# Altium schematic sheet supply_external.SchDoc: foxBMS BMS-Master
size A3; DocumentNumber: 2; SheetNumber: 2; SheetTotal: 24; Author: Fraunhofer IISB foxBMS Team; REL-DATE: 2017-05-16; VERSION: 1.0.2; SheetDescription: Supply for MCU0 and peripherals
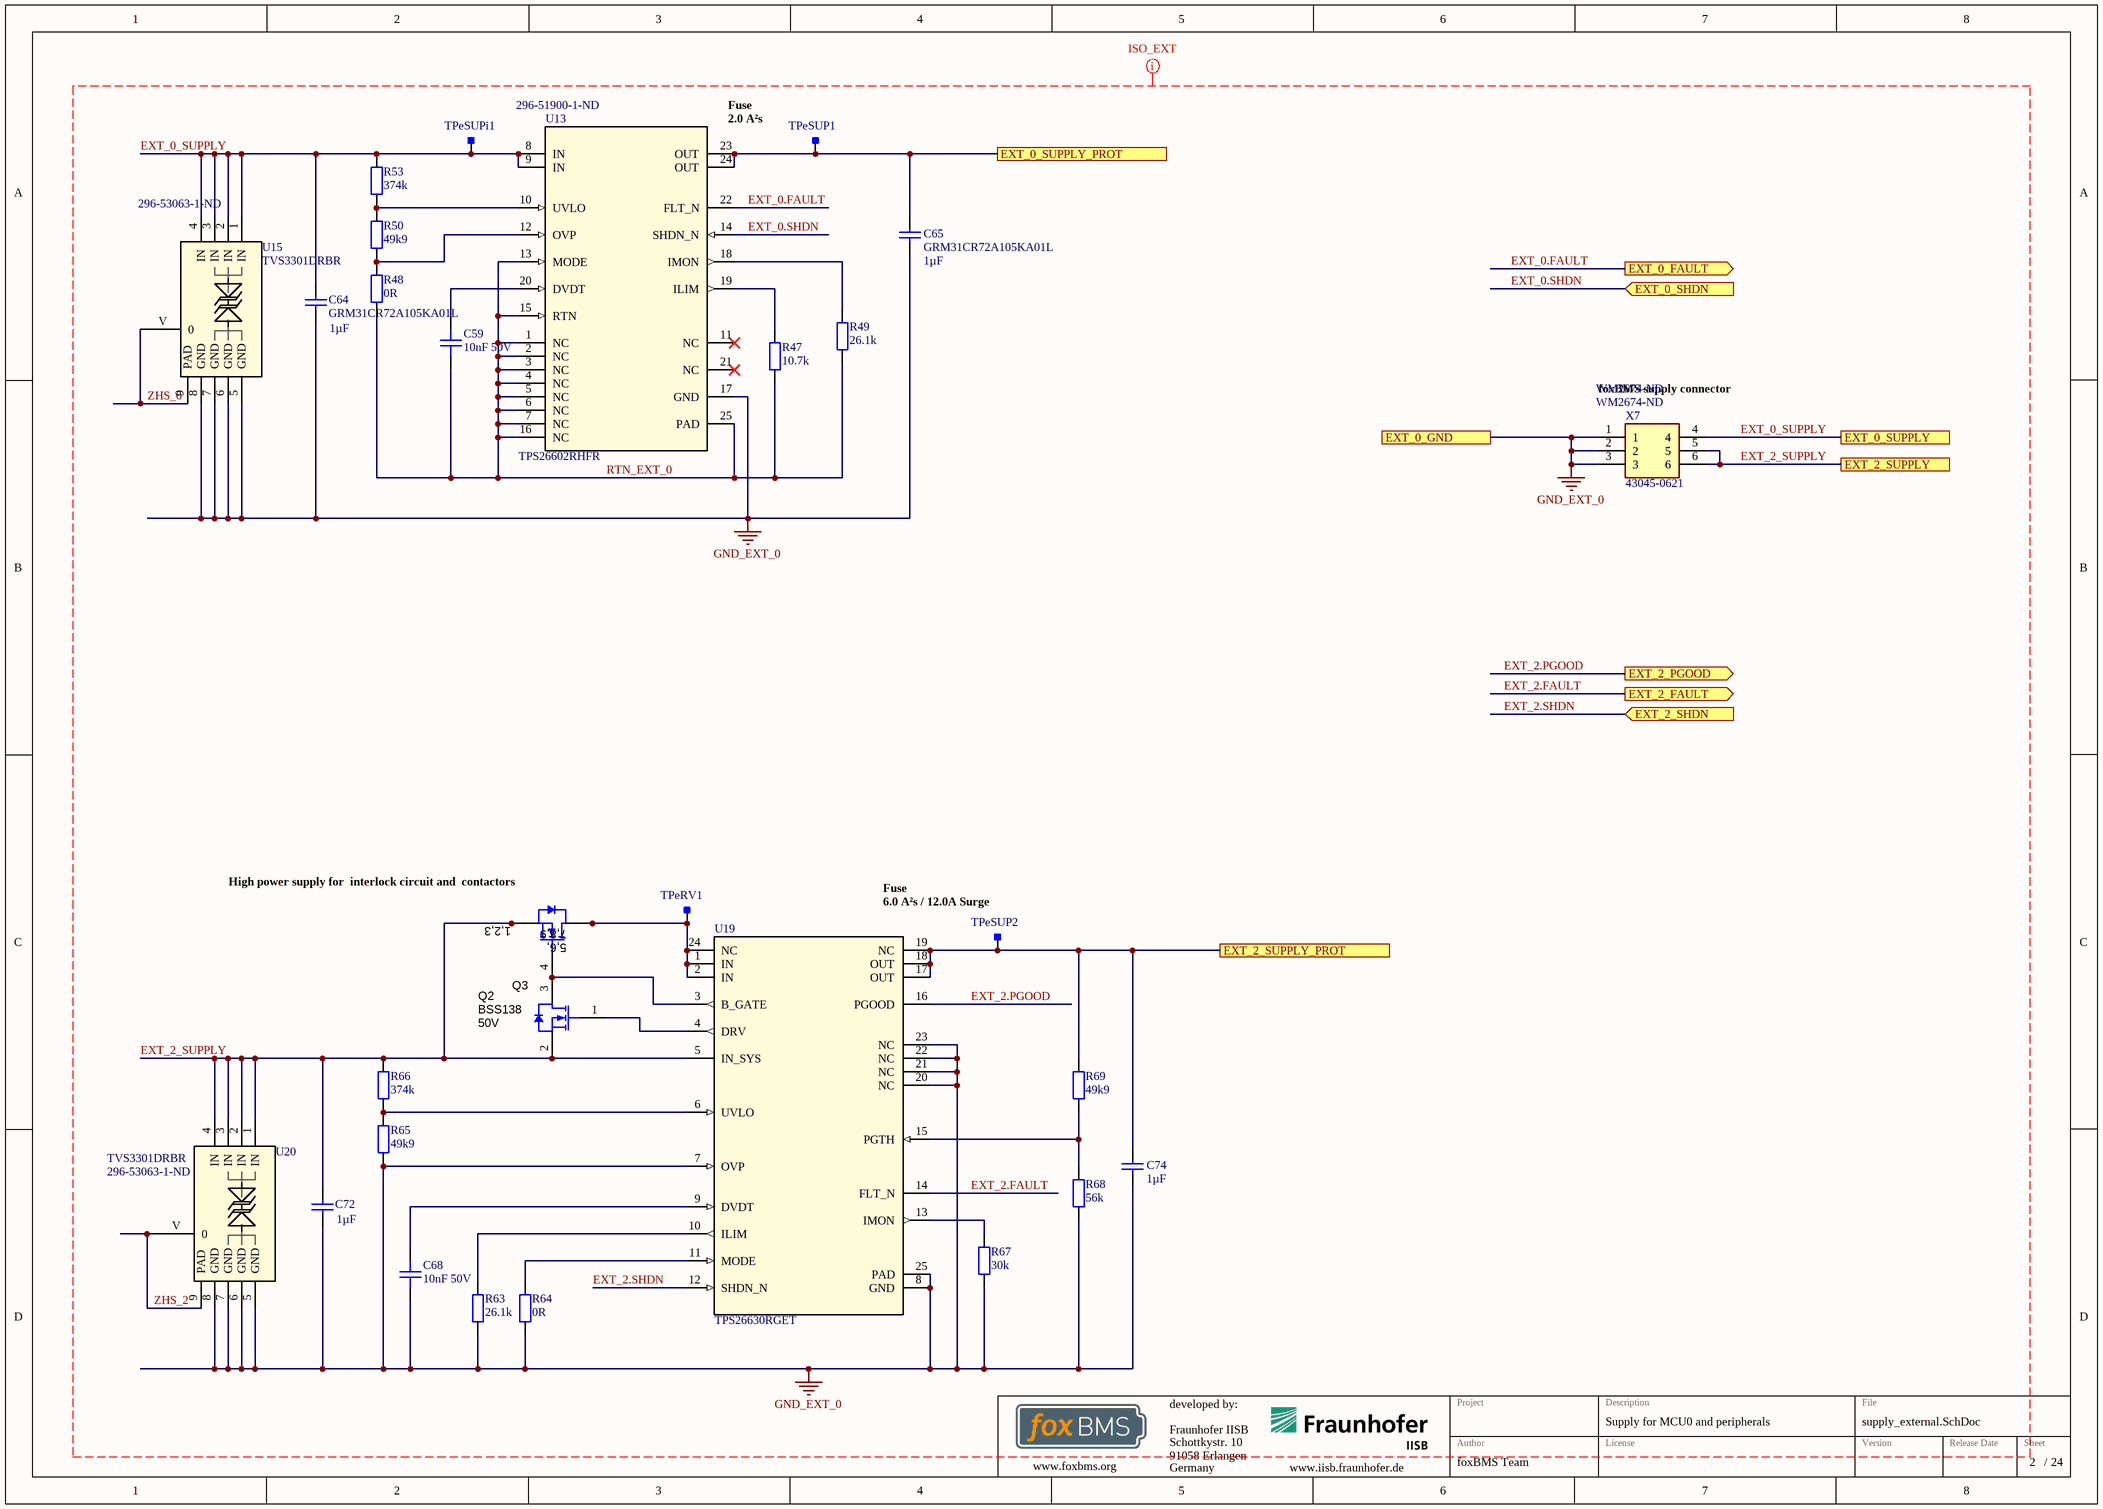
[diagram p0: supply_external.SchDoc]

## Parts
C59  10nF 50V  [0402C]
C64  GRM31CR72A105KA01L  Capacitance: 1µF  [CAPC3216X180X55ML20T25]
C65  GRM31CR72A105KA01L  Capacitance: 1µF  [CAPC3216X180X55ML20T25]
C68  10nF 50V  [0402C]
C72  Capacitance: 1µF  [CAPC3216X180X55ML20T25]  (hidden comment: GRM31CR72A105KA01L)
C74  Capacitance: 1µF  [CAPC3216X180X55ML20T25]  (hidden comment: GRM31CR72A105KA01L)
Q2  BSS138  value 50V  [SOT-23]
Q3  CSD17308Q3  [SONQ3A]  (value not drawn)
R47  10.7k  [0402R]
R48  0R  [0402R]
R49  26.1k  [0402R]
R50  49k9  [0402R]
R53  374k  [0402R]
R63  26.1k  [0402R]
R64  0R  [0402R]
R65  49k9  [0402R]
R66  374k  [0402R]
R67  30k  [0402R]
R68  56k  [0402R]
R69  49k9  [0402R]
TPeRV1  Testpoint_Square  [Testpoint_S1]  (value not drawn)  (no BOM)
TPeSUP1  Testpoint_Square  [Testpoint_S1]  (value not drawn)  (no BOM)
TPeSUP2  Testpoint_Square  [Testpoint_Keystone_Miniature]  (value not drawn)  (no BOM)
TPeSUPi1  Testpoint_Square  [Testpoint_S1]  (value not drawn)  (no BOM)
U13  TPS26602RHFR  Supplier Part Number 1: 296-51900-1-ND  [RHF0024A]
U15  TVS3301DRBR  Supplier Part Number 1: 296-53063-1-ND  [DRB0008F]
U19  TPS26630RGET  [RGE0024H]
U20  TVS3301DRBR  Supplier Part Number 1: 296-53063-1-ND  [DRB0008F]
X7  43045-0621  Supplier Part Number 1: WM2674-ND  [43045-0621]

## Ports
EXT_0_FAULT (out), EXT_0_GND, EXT_0_SHDN (in), EXT_0_SUPPLY, EXT_0_SUPPLY_PROT, EXT_2_FAULT (out), EXT_2_PGOOD (out), EXT_2_SHDN (in), EXT_2_SUPPLY, EXT_2_SUPPLY_PROT

## Nets
GND_EXT_0: C64.1 C65.1 C68.2 C72.1 C74.1 R63.1 R64.1 R65.1 R67.1 R68.1 U13.17(GND) U15.5(GND) U15.6(GND) U15.7(GND) U15.8(GND) U19.7(OVP) U19.8(GND) U19.20(NC) U19.21(NC) U19.22(NC) U19.23(NC) U19.25(PAD) U20.5(GND) U20.6(GND) U20.7(GND) U20.8(GND) X7.1 X7.2 X7.3 ; port EXT_0_GND
EXT_0.FAULT: U13.22(FLT_N) ; port EXT_0_FAULT
EXT_0.SHDN: U13.14(SHDN_N) ; port EXT_0_SHDN
EXT_0_SUPPLY: C64.2 R53.2 TPeSUPi1.1 U13.8(IN) U13.9(IN) U15.1(IN) U15.2(IN) U15.3(IN) U15.4(IN) X7.4 ; port EXT_0_SUPPLY
EXT_0_SUPPLY_PROT: C65.2 TPeSUP1.1 U13.23(OUT) U13.24(OUT) ; port EXT_0_SUPPLY_PROT
EXT_2.FAULT: U19.14(FLT_N) ; port EXT_2_FAULT
EXT_2.PGOOD: U19.16(PGOOD) ; port EXT_2_PGOOD
EXT_2.SHDN: U19.12(SHDN_N) ; port EXT_2_SHDN
EXT_2_SUPPLY: C72.2 Q2.2(S) Q3.1(S) Q3.2(S) Q3.3(S) R66.2 U19.5(IN_SYS) U20.1(IN) U20.2(IN) U20.3(IN) U20.4(IN) X7.5 X7.6 ; port EXT_2_SUPPLY
EXT_2_SUPPLY_PROT: C74.2 R69.2 TPeSUP2.1 U19.17(OUT) U19.18(OUT) U19.19(NC) ; port EXT_2_SUPPLY_PROT
RTN_EXT_0: C59.2 R47.1 R48.1 R49.1 U13.1(NC) U13.2(NC) U13.3(NC) U13.4(NC) U13.5(NC) U13.6(NC) U13.7(NC) U13.13(MODE) U13.15(RTN) U13.16(NC) U13.25(PAD)
ZHS_0: U15.9(PAD) U15.V(0)
ZHS_2: U20.9(PAD) U20.V(0)
NetC59_1: C59.1 U13.20(DVDT)
NetC68_1: C68.1 U19.9(DVDT)
NetQ2_1: Q2.1(G) U19.4(DRV)
NetQ2_3: Q2.3(D) Q3.4(G) U19.3(B_GATE)
NetQ3_5: Q3.5(D) Q3.6(D) Q3.7(D) Q3.8(D) Q3.9(D) TPeRV1.1 U19.1(IN) U19.2(IN) U19.24(NC)
NetR47_2: R47.2 U13.19(ILIM)
NetR48_2: R48.2 R50.1 U13.12(OVP)
NetR49_2: R49.2 U13.18(IMON)
NetR50_2: R50.2 R53.1 U13.10(UVLO)
NetR63_2: R63.2 U19.10(ILIM)
NetR64_2: R64.2 U19.11(MODE)
NetR65_2: R65.2 R66.1 U19.6(UVLO)
NetR67_2: R67.2 U19.13(IMON)
NetR68_2: R68.2 R69.1 U19.15(PGTH)

Not connected (* = marked no-connect by the designer): U13 11(NC)* 21(NC)*

## Layout directives
net class ISO_EXT: EXT_0.FAULT, EXT_0.SHDN, EXT_0_SUPPLY, EXT_2.FAULT, EXT_2.PGOOD, EXT_2.SHDN, EXT_2_SUPPLY, GND_EXT_0, RTN_EXT_0, ZHS_0, ZHS_2

## Notes on the sheet
- Fuse
- 2.0 A²s
- (near X7) foxBMS supply connector
- (near Q3) High power supply for
  interlock circuit and
  contactors
- 6.0 A²s / 12.0A Surge
- Fraunhofer IISB
- Schottkystr. 10
- developed by:
- 91058 Erlangen
- Germany
- Author
- Project
- License
- Description
- File
- Version
- Release Date
- Sheet
- www.foxbms.org
- www.iisb.fraunhofer.de
- foxBMS Team
- /
- (in symbol CSD17308Q3) 1,2,3; 7,8,9; 5,6,

## Library data of the parts
C59 C68 = gen_C_ceramic_10n_50V_X7R_0402: Ceramic, 10nF, ±10%, 50V, X7R, –55 to 125°C, 0402 (1005),RoHS, Automotive; Part Number: GRT155R71H104KE01; Automotive Qualified: True; Capacitance: 10n; Case EIA: 0402; Case Metric: 1005; PnP Package: C_0402_10; PnP Value: 10n/50V/X7R; Dielectric: X7R; Rated Voltage: 50V
C64 C65 C72 C74 = gen_C_ceramic_1u_100V_X7R_1206: Chip Capacitor, 1 uF, +/- 10%, 100 V, -55 to 125 degC, 1206 (3216 Metric), RoHS, Tape and Reel; Manufacturer: Murata; Catalog Drawings: GRMSeries_1206_1.6; Featured Product: GA3SafetyRecognizedCapsandHi-CapMLCC; Online Catalog: GRMSeries; Temperature Coefficient: X7R; Product Training Modules: High-CapMultilayerCeramicCapacitors; Other Names: 490-3909-6; Voltage - Rated: 100V; Case EIA: 1206; PnP Package: C_1206_10; PnP Value: 1.0µF/100V/X7R; Height - Seated (Max): -; Features: -; Applications: GeneralPurpose; Manufacturer URL: http://www.murata.com/; Standard Package: 1; Package Reference: 1206; Series: GRM; Package / Case: 1206(3216Metric); Datasheet Version: Sep-11; Ratings: -; Category: Capacitors; Datasheet URL: https://datasheet.ciiva.com/29199/454987-da-01-en-vs-kondensator-1206-29199435.pdf; Operating Temperature: -55degC~125degC; Lead Spacing: -; Family: CeramicCapacitors; Tolerance: ±10%; Packaging: Digi-Reel; Mounting Type: SurfaceMount,MLCC; Package Description: 2-Pin Surface Mount Device, Body 3.2 x 1.6 mm; Lead Style: -; Thickness (Max): 0.071"(1.80mm); Size / Dimension: 0.126"Lx0.063"W(3.20mmx1.60mm); Dielectric: X7R; Rated Voltage: 100V
Q2 = BSS138: MOSFET, N-CH, 50V, 0.22A, SOT-23; Manufacturer: Fairchild Semiconductor; Alternate Manufacturer: None; U/M: EA; ChType: N; VdsMax_V: 50; Value1: 6 ohm; Rdson45_Ohm: 6; Value2: 1.7 nC; QgTyp_nC: 1.7; Vgs_V: 20; IdsMax_A: 0.22; ComponentLink1URL: http://www.fairchildsemi.com/ds/BS/BSS138.pdf; SymbolVersion: 2008-07-28; PackageReference: SOT-23; PartNumber: BSS138; ComponentLink1Description: Datasheet link; CompType: MOSFET; RoHS: Y; MountType: SMT; Published: 2008-06-19; Publisher: Texas Instruments; LatestRevisionDate: 2013-07-10; LatestRevisionNote: Added parts.; Supplier 1: Digi-Key; Supplier Part Number 1: BSS138CT-ND; Supplier 2: Mouser; Supplier Part Number 2: 512-BSS138; Supplier 3: Farnell; Supplier Part Number 3: 9845330
Q3 = CSD17308Q3: MOSFET, N-CH, 30V, 47A, SON 3.3x3.3mm; Manufacturer: Texas Instruments; Alternate Manufacturer: None; U/M: EA; ChType: N; VdsMax_V: 30; Value1: 0.0094 ohm; Rdson45_Ohm: 0.0094; Value2: 3.9 nC; QgTyp_nC: 3.9; Vgs_V: 10; IdsMax_A: 47; SymbolVersion: 2008-07-09; CompType: MOSFET; Value: 30V; PartNumber: CSD17308Q3; PackageReference: SON 3.3x3.3mm; RoHS: Y; MountType: SMT; Published: 2008-06-19; Publisher: Texas Instruments; LatestRevisionDate: 2013-07-24; LatestRevisionNote: Added parts.; ComponentLink1Description: Datasheet link; ComponentLink1URL: http://www.ti.com/lit/ds/symlink/csd17308q3.pdf; Supplier 1: Digi-Key; Supplier Part Number 1: 296-27210-1-ND; Supplier 2: Mouser; Supplier Part Number 2: 595-CSD17308Q3; Supplier 3: Farnell; Supplier Part Number 3: 1892457
R47 = gen_R_10K7_0402: SMD Resistor 10.7k 0402; Part Number: gen_R_10.7k_0402; Case EIA: 0402; Case Metric: 1005; PnP Package: R_0402; Automotive Qualified: False; PnP Value: 10.7k; Operating Temperature: -55°C - +155°C
R48 R64 = gen_R_0R_0402: SMD Resistor 0R 0402; Case EIA: 0402; Case Metric: 1005; PnP Package: R_0402; Automotive Qualified: False; PnP Value: 0R; Part Number: gen_R_0R_0402; Operating Temperature: -55°C - +155°C
R49 R63 = gen_R_26k1_0402: SMD Resistor 26.1k 0402; Part Number: gen_R_26.1k_0402; Case EIA: 0402; Case Metric: 1005; PnP Package: R_0402; Automotive Qualified: False; PnP Value: 26.1k; Operating Temperature: -55°C - +155°C
R50 R65 R69 = gen_R_49k9_0402: SMD Resistor 49.9k 0402; Case EIA: 0402; Case Metric: 1005; PnP Package: R_0402; Automotive Qualified: False; PnP Value: 49k9; Operating Temperature: -55°C - +155°C; Part Number: gen_R_49k9_0402
R53 R66 = gen_R_374k_0402: SMD Resistor 374k 0402; Case EIA: 0402; Case Metric: 1005; PnP Package: R_0402; Automotive Qualified: False; PnP Value: 374k; Operating Temperature: -55°C - +155°C; Part Number: gen_R_374k_0402
R67 = gen_R_10K7_0402: SMD Resistor 30k 0402; Part Number: gen_R_10.7k_0402; Case EIA: 0402; Case Metric: 1005; PnP Package: R_0402; PnP Value: 10.7k; Automotive Qualified: False; Operating Temperature: -55°C - +155°C
R68 = gen_R_49k9_0402: SMD Resistor 49.9k 0402; Case EIA: 0402; Case Metric: 1005; PnP Package: R_0402; PnP Value: 49k9; Automotive Qualified: False; Operating Temperature: -55°C - +155°C; Part Number: gen_R_49k9_0402
TPeRV1 TPeSUP1 TPeSUP2 TPeSUPi1 = Testpoint_Square: Testpoint, square; Part Number: Testpoint_Square
U13 = TPS26602RHFR: 37V Clamped input protection; Manufacturer: Texas Instruments; PartNumber: TPS26602RHFR; RefDes: RefDes; TYPE: TYPE; Value: Value; Part Number: TPS26602RHFR; Supplier 1: Digi-Key
U15 U20 = TVS3301DRVR: TVS3301 33-V Bidirectional Flat-Clamp Surge Protection Device; Manufacturer: Texas Instruments; Part Number: TVS3301DRBR; RefDes: RefDes; TYPE: TYPE; Value: Value; Supplier 1: Digi-Key
U19 = TPS26630RGET: Imported; Manufacturer: Texas Instruments; PartNumber: TPS26630RGER; RefDes: RefDes; TYPE: TYPE; Value: Value
X7 = 43045-0621: Micro-Fit 3.0 Right Angle Header, 3.00mm Pitch, Dual Row, 6 Circuits, with Snap-in Plastic Peg PCB Lock, Tin, Glow Wire Capable, Black, 43045-0621; Manufacturer_Name: Molex; Part Name: MicroFit; Circuits: 6; Datasheet Link: http://www.molex.com/webdocs/datasheets/pdf/en-us//0430450621_PCB_HEADERS.pdf; Height: 8mm; Manufacturer_Part_Number: 43045-0621; Mouser Part Number: 538-43045-0621; Mouser Price/Stock: https://www.mouser.com/Search/Refine.aspx?Keyword=538-43045-0621; RS Part Number: 6700380; RS Price/Stock: https://uk.rs-online.com/web/p/products/6700380; Supplier 1: Digi-Key; Supplier 2: Digi-Key; Supplier Part Number 2: WM2674-ND